# Altium schematic sheet Sheet3.SchDoc
size A4; SheetNumber: 1; SheetTotal: 1
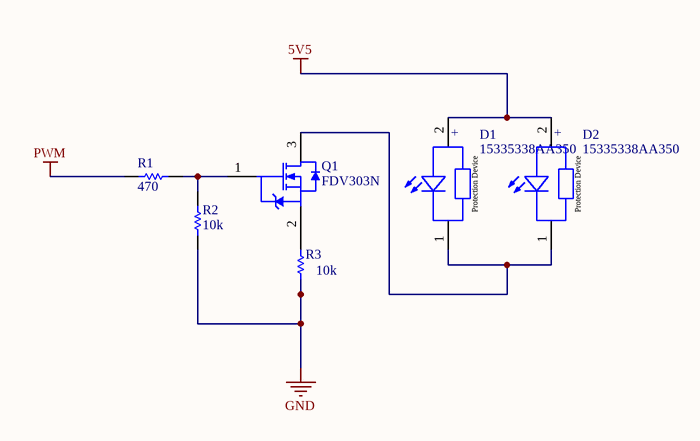
[diagram p0: Sheet3.SchDoc]

## Parts
D1  15335338AA350  [WL-SUMW_3535 UV-A_L3.4W3.4H2.1]
D2  15335338AA350  [WL-SUMW_3535 UV-A_L3.4W3.4H2.1]
Q1  FDV303N  [FAIR-FDV303N-3_V]
R1  470  [RESC1609X50X30NL8T20]
R2  10k  [RESC1609X50X30NL8T20]
R3  10k  [RESC1609X50X30NL8T20]

## Nets
5V5: D1.2(A) D2.2(A)
GND: R2.1 R3.1
PWM: R1.1
NetD1_1: D1.1(K) D2.1(K) Q1.3(D)
NetQ1_1: Q1.1(G) R1.2 R2.2
NetQ1_2: Q1.2(S) R3.2

## Notes on the sheet
- (in symbol CMP-03913-78125603-1) +; Protection Device

## Library data of the parts
D1 D2 = CMP-03913-78125603-1: 15335338AA350 WL-SUMW SMT UltraViolet Ceramic Waterclear; Forward Voltage: 3.5V; Peak Wavelength: 385nm; Viewing Angle: 130°; Forward Current: 1A; Packaging: Tape and Reel; Min Operating Temperature: -40°C; Length: 3.45mm; Height: 2mm; RoHS: Compliant; Width: 3.45mm; Wavelength: 385nm; Max Operating Temperature: 85°C; NexarPartId: 78125603
Q1 = CMP-2000-05111-1: N-Channel MOSFET Transistor, 8 V VGSS, 25 V VDSS, 0.68 A, -55 to 150 degC, 3-Pin SOT23, RoHS, Tape and Reel; Manufacturer: Fairchild; Typical Turn-On Delay Time: 3ns; Channel Mode: Enhancement; RDS-on: 450@4.5VmOhm; Maximum Continuous Drain Current: 0.68A; Maximum Drain Source Voltage: 25V; Rad Hard: No; Typical Fall Time: 13ns; Channel Type: N; Typical Turn-Off Delay Time: 17ns; Maximum Gate Source Voltage: 8V; Typical Rise Time: 8.5ns; Mounting: SurfaceMount; Packaging: Tape&Reel; Manufacturer URL: https://www.fairchildsemi.com/; Datasheet URL: https://datasheet.ciiva.com/22681/1845307-22681736.pdf; Package: 3SOT-23; Category: MOSFET; Operating Temperature: -55to150degC; Datasheet Version: Rev. D2, 07/2014
R1-R3 = CMP-2000-03816-5: Chip Resistor, 0 Ohm, Jumper, 100 mW, -55 to 155 degC, 0603 (1608 Metric), RoHS, Tape and Reel; Manufacturer: Vishay Semiconductor; Voltage Rating: 75 V; Package Quantity: 5000; DatasheetVersion: 06/2012; Min Operating Temperature: -55 degC; ComponentLink1URL: http://www.vishay.com/; Mounting Technology: Surface Mount; Height: 0.45 mm; ComponentLink1Description: Manufacturer URL; REACH SVHC: Unknown; PackageReference: 0603; Packaging: Tape and Reel; Max Operating Temperature: 155 degC; Mount: Surface Mount; ComponentLink2Description: Datasheet; PackageDescription: 2-Pin Surface Mount Device, Body 1.575 x 0.85 mm; Length: 1.55 mm; ComponentLink2URL: http://www.vishay.com/docs/20035/dcrcwe3.pdf; Pins: 2; RoHSCompliant: true